# EAGLE design quad_cape (EAGLE 6.1)
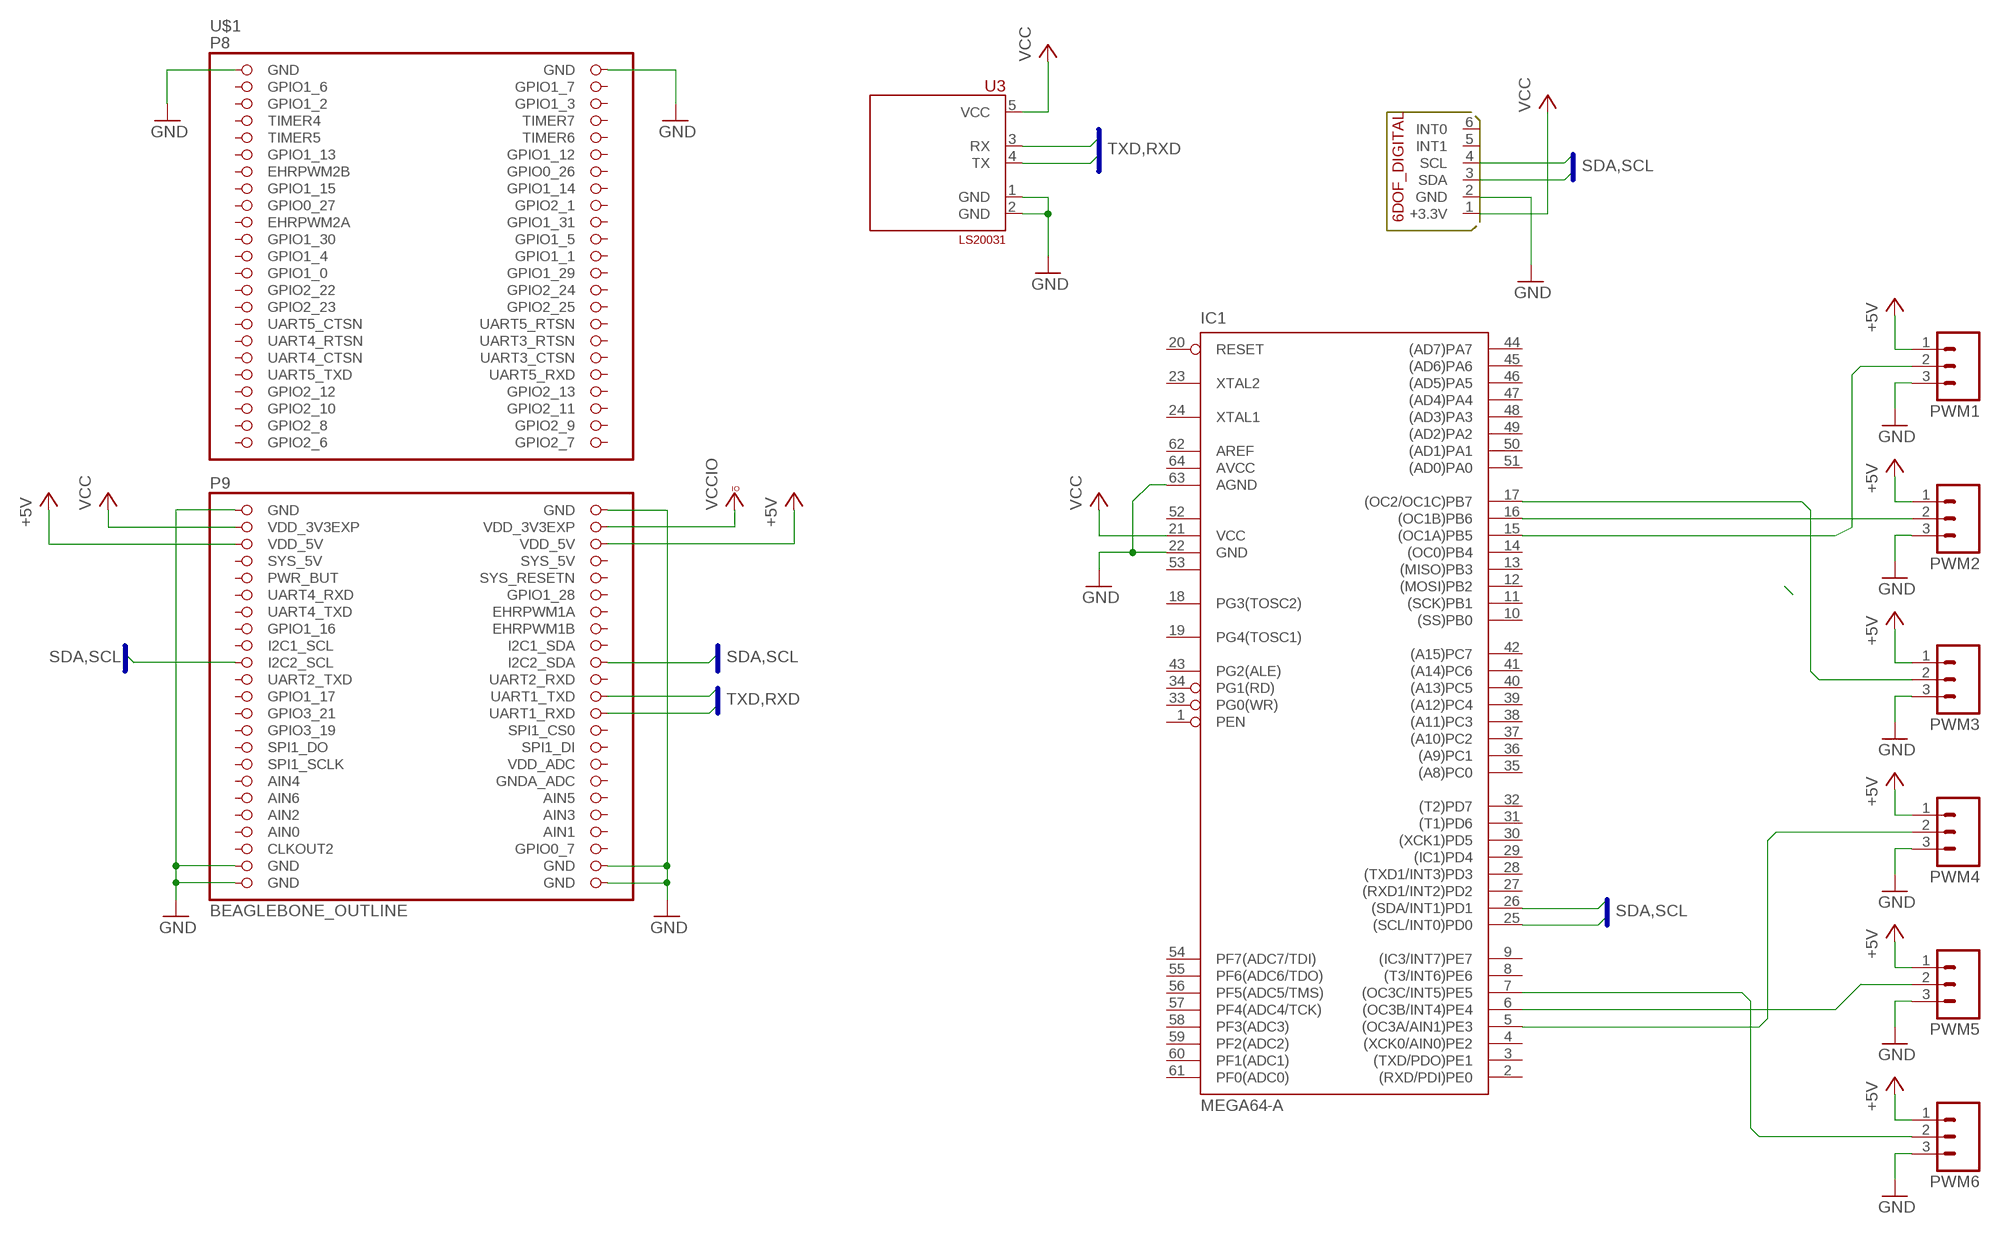
[diagram p0: schematic, sheet 1]

## Parts
IC1  MEGA64-A  [TQFP64]
PWM1  M03  [JST-3-SMD]
PWM2  M03  [JST-3-SMD]
PWM3  M03  [JST-3-SMD]
PWM4  M03  [JST-3-SMD]
PWM5  M03  [JST-3-SMD]
PWM6  M03  [JST-3-SMD]
U3  LS20031  [LS20031]
U$1  BEAGLEBONE_OUTLINE  [BEAGLEBONE_SHIELD]
U$2  6DOF-DIGITAL  [6DOF_DIGITAL_V10]

## Nets
+5V: PWM1.1 PWM2.1 PWM3.1 PWM4.1 PWM5.1 PWM6.1 U$1.51(VDD_5V) U$1.52(VDD_5V)
GND: IC1.22(GND) IC1.63(AGND) PWM1.3 PWM2.3 PWM3.3 PWM4.3 PWM5.3 PWM6.3 U3.1(GND) U3.2(GND) U$1.1(GND) U$1.2(GND) U$1.47(GND) U$1.48(GND) U$1.89(GND) U$1.90(GND) U$1.91(GND) U$1.92(GND) U$2.2(GND)
PWM1: IC1.15((OC1A)PB5) PWM1.2
PWM2: IC1.16((OC1B)PB6) PWM2.2
PWM3: IC1.17((OC2/OC1C)PB7) PWM3.2
PWM4: IC1.5((OC3A/AIN1)PE3) PWM4.2
PWM5: IC1.6((OC3B/INT4)PE4) PWM5.2
PWM6: IC1.7((OC3C/INT5)PE5) PWM6.2
RXD: U3.4(TX) U$1.72(UART1_RXD)
SCL: IC1.25((SCL/INT0)PD0) U$1.65(I2C2_SCL) U$2.4(SCL)
SDA: IC1.26((SDA/INT1)PD1) U$1.66(I2C2_SDA) U$2.3(SDA)
TXD: U3.3(RX) U$1.70(UART1_TXD)
VCC: IC1.21(VCC) U3.5(VCC) U$1.49(VDD_3V3EXP) U$2.1(+3.3V)
VCCIO: U$1.50(VDD_3V3EXP)
Unconnected: IC1.1(PEN) IC1.2((RXD/PDI)PE0) IC1.3((TXD/PDO)PE1) IC1.4((XCK0/AIN0)PE2) IC1.8((T3/INT6)PE6) IC1.9((IC3/INT7)PE7) IC1.10((SS)PB0) IC1.11((SCK)PB1) IC1.12((MOSI)PB2) IC1.13((MISO)PB3) IC1.14((OC0)PB4) IC1.18(PG3(TOSC2)) IC1.19(PG4(TOSC1)) IC1.20(RESET) IC1.23(XTAL2) IC1.24(XTAL1) IC1.27((RXD1/INT2)PD2) IC1.28((TXD1/INT3)PD3) IC1.29((IC1)PD4) IC1.30((XCK1)PD5) IC1.31((T1)PD6) IC1.32((T2)PD7) IC1.33(PG0(WR)) IC1.34(PG1(RD)) IC1.35((A8)PC0) IC1.36((A9)PC1) IC1.37((A10)PC2) IC1.38((A11)PC3) IC1.39((A12)PC4) IC1.40((A13)PC5) IC1.41((A14)PC6) IC1.42((A15)PC7) IC1.43(PG2(ALE)) IC1.44((AD7)PA7) IC1.45((AD6)PA6) IC1.46((AD5)PA5) IC1.47((AD4)PA4) IC1.48((AD3)PA3) IC1.49((AD2)PA2) IC1.50((AD1)PA1) IC1.51((AD0)PA0) IC1.54(PF7(ADC7/TDI)) IC1.55(PF6(ADC6/TDO)) IC1.56(PF5(ADC5/TMS)) IC1.57(PF4(ADC4/TCK)) IC1.58(PF3(ADC3)) IC1.59(PF2(ADC2)) IC1.60(PF1(ADC1)) IC1.61(PF0(ADC0)) IC1.62(AREF) IC1.64(AVCC) U$1.5(GPIO1_2) U$1.6(GPIO1_3) U$1.7(TIMER4) U$1.8(TIMER7) U$1.9(TIMER5) U$1.10(TIMER6) U$1.11(GPIO1_13) U$1.12(GPIO1_12) U$1.13(EHRPWM2B) U$1.14(GPIO0_26) U$1.15(GPIO1_15) U$1.16(GPIO1_14) U$1.17(GPIO0_27) U$1.18(GPIO2_1) U$1.19(EHRPWM2A) U$1.20(GPIO1_31) U$1.21(GPIO1_30) U$1.22(GPIO1_5) U$1.23(GPIO1_4) U$1.24(GPIO1_1) U$1.25(GPIO1_0) U$1.26(GPIO1_29) U$1.27(GPIO2_22) U$1.28(GPIO2_24) U$1.29(GPIO2_23) U$1.30(GPIO2_25) U$1.31(UART5_CTSN) U$1.32(UART5_RTSN) U$1.33(UART4_RTSN) U$1.34(UART3_RTSN) U$1.35(UART4_CTSN) U$1.36(UART3_CTSN) U$1.37(UART5_TXD) U$1.38(UART5_RXD) U$1.39(GPIO2_12) U$1.40(GPIO2_13) U$1.41(GPIO2_10) U$1.53(SYS_5V) U$1.54(SYS_5V) U$1.55(PWR_BUT) U$1.56(SYS_RESETN) U$1.57(UART4_RXD) U$1.58(GPIO1_28) U$1.59(UART4_TXD) U$1.60(EHRPWM1A) U$1.61(GPIO1_16) U$1.62(EHRPWM1B) U$1.63(I2C1_SCL) U$1.64(I2C1_SDA) U$1.67(UART2_TXD) U$1.68(UART2_RXD) U$1.69(GPIO1_17) U$1.71(GPIO3_21) U$1.73(GPIO3_19) U$1.74(SPI1_CS0) U$1.75(SPI1_DO) U$1.76(SPI1_DI) U$1.77(SPI1_SCLK) U$1.78(VDD_ADC) U$1.79(AIN4) U$1.80(GNDA_ADC) U$1.81(AIN6) U$1.82(AIN5) U$1.83(AIN2) U$1.86(AIN1) U$1.87(CLKOUT2) U$1.88(GPIO0_7) U$2.5(INT1) U$2.6(INT0)

## Buses
SDA,SCL
TXD,RXD

## Power pins joined to a net without a drawn wire
AIN0: U$1.85(AIN0)
AIN3: U$1.84(AIN3)
GND1: IC1.53(GND1)
GPIO1_6: U$1.3(GPIO1_6)
GPIO1_7: U$1.4(GPIO1_7)
GPIO2_6: U$1.45(GPIO2_6)
GPIO2_7: U$1.46(GPIO2_7)
GPIO2_8: U$1.43(GPIO2_8)
GPIO2_9: U$1.44(GPIO2_9)
GPIO2_11: U$1.42(GPIO2_11)
VCC1: IC1.52(VCC1)

## Library data of the parts
IC1 = avr:MEGA64: MICROCONTROLLER 64 Kbytes FLASH 4 Kbytes SRAM 2 Kbytes EEPROM DUAL USART 8-channel 10 bit ADC
PWM1-PWM6 = SparkFun-Connectors:M03: Header 3 Standard 3-pin 0.1" header. Use with straight break away headers (SKU : PRT-00116), right angle break away headers (PRT-00553), swiss pins (PRT-00743), machine pins (PRT-00117), and female headers (PRT-00115). Molex polarized connector foot print use with SKU : PRT-08232 with associated crimp pins and housings.
U3 = custom:LS20031: 66 Channel LS20031 GPS 5Hz Receiver
U$1 = adafruit:BEAGLEBONE_OUTLINE: Should match A3 pinout - but not completely tested
U$2 = SparkFun-Breakouts:6DOF-DIGITAL

## Board
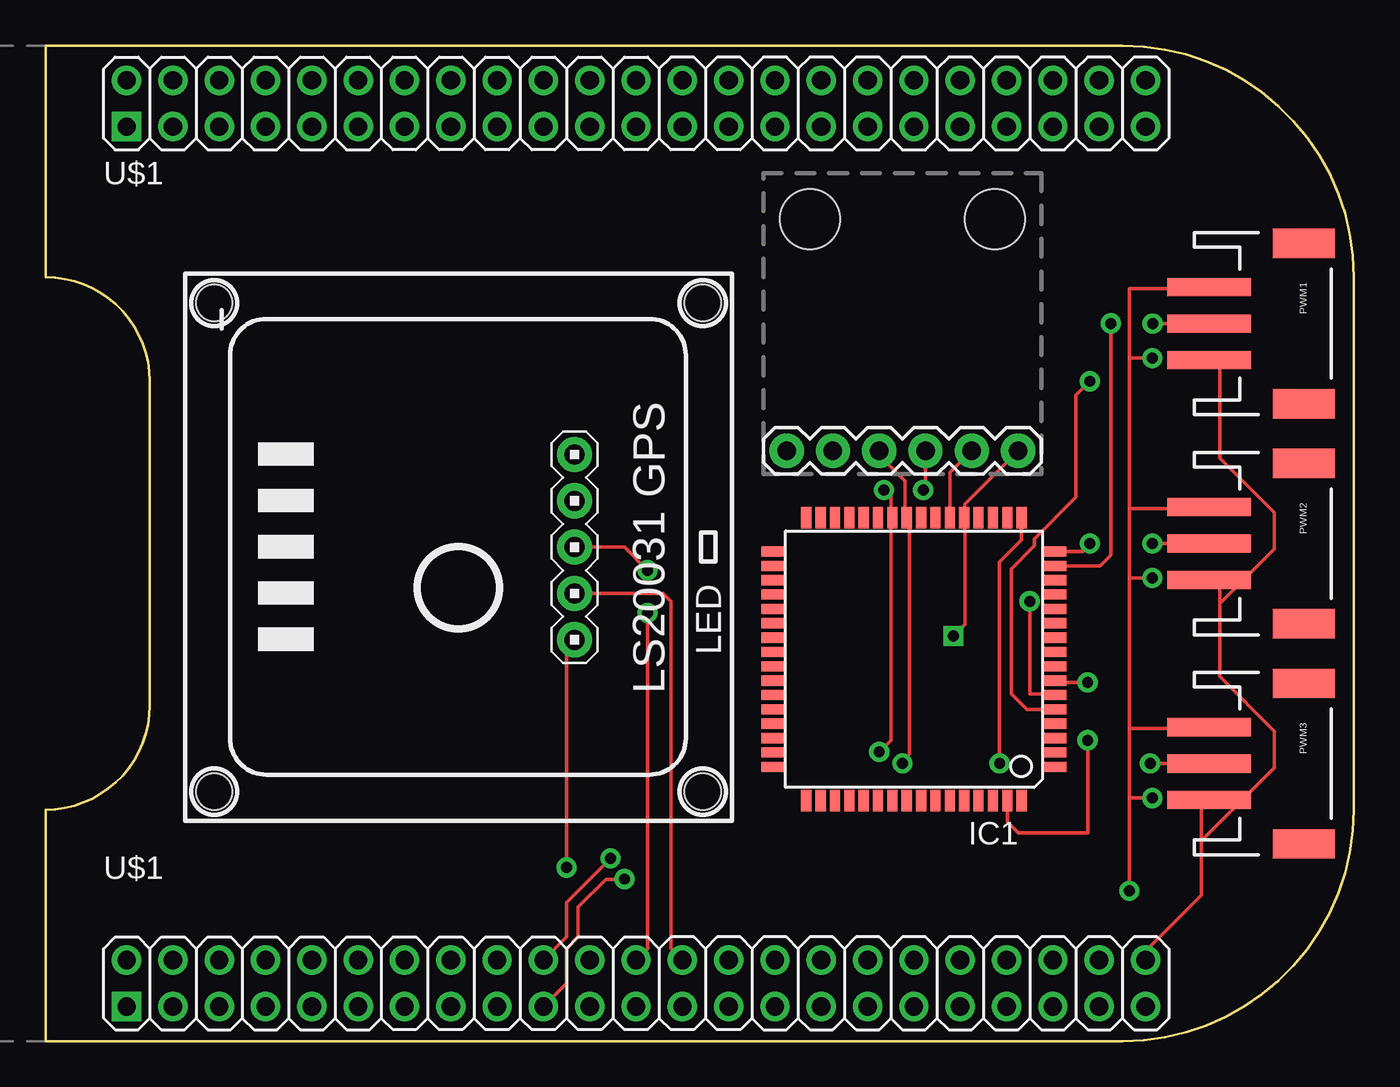
[diagram p1: board, top side]
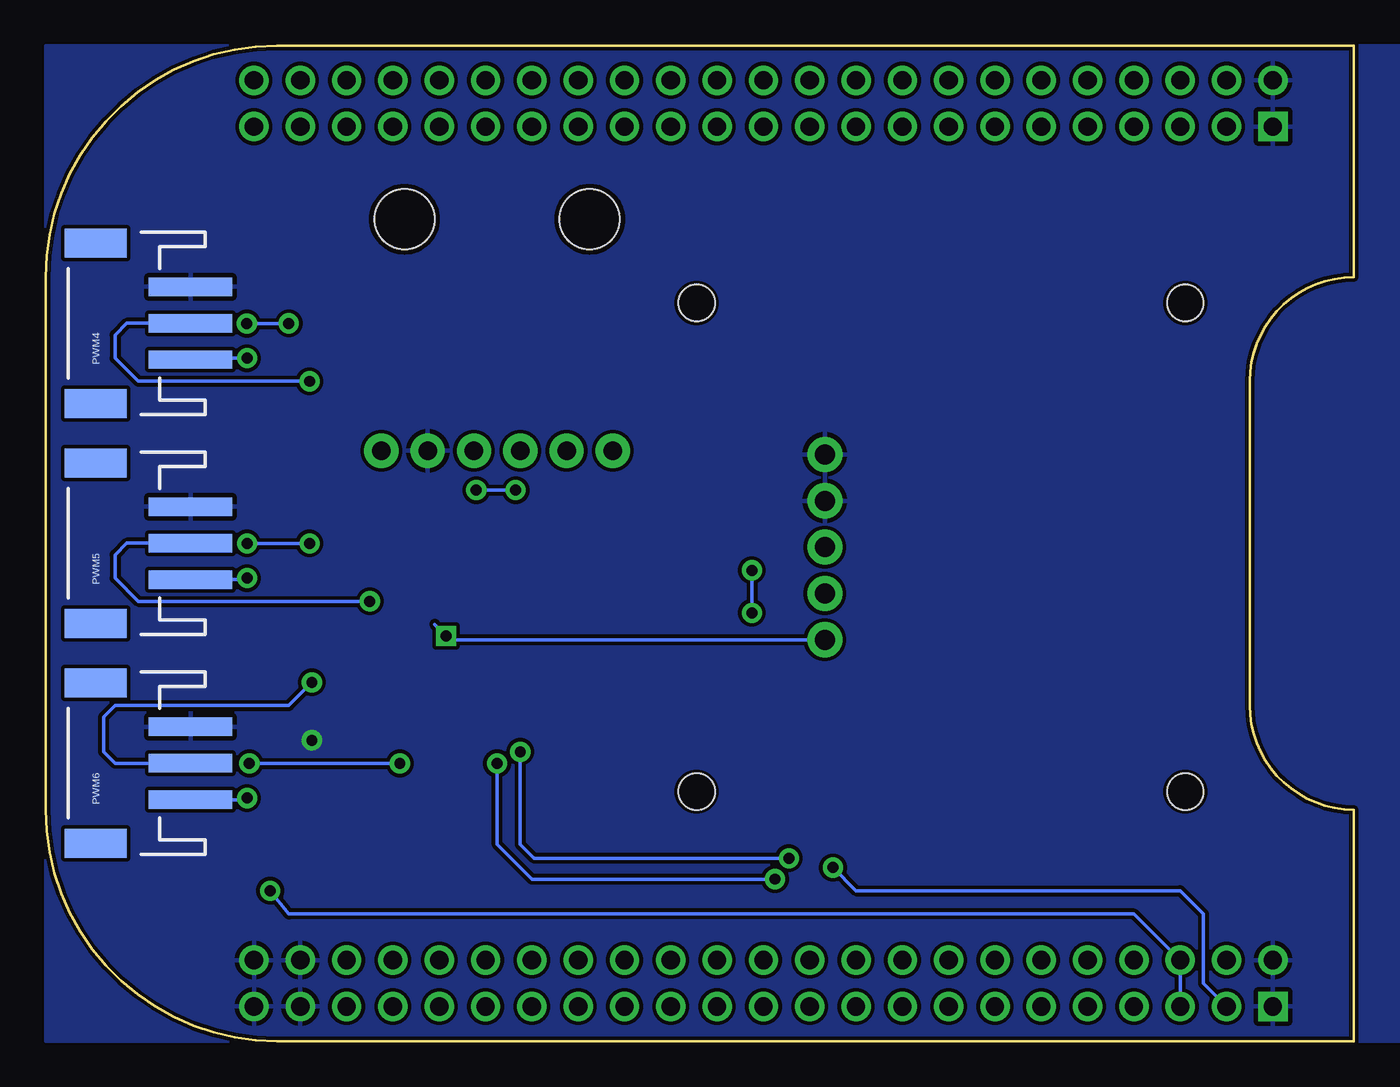
[diagram p2: board, bottom side, seen from below]

Size 71.75 x 54.61 mm. Coordinates in mm from the lower left corner, seen from the top.
Copper layers (1*16): Top 0.035mm / dielectric 1.5mm / Bottom 0.035mm
Design rules: minimum track width 8mil, minimum drill 20mil, track to track 8mil, track to pad 8mil, pad to pad 8mil, via to via 8mil, smd to smd 8mil, copper to edge 8mil, drill to drill 8mil, minimum pad ring 12mil, minimum via ring 10mil, stop-mask expansion 4mil, vias tented up to drill 25mil, thermal gap 10mil

### Footprints (pad centres in the part's own frame; a part is rotated, then mirrored left to right if it is on the bottom)
TQFP64 = smd 1.194 x 0.559: 1 -7.76,5.905; 2 -7.76,5.118; 3 -7.76,4.331; 4 -7.76,3.543; 5 -7.76,2.756; 6 -7.76,1.968; 7 -7.76,1.181; 8 -7.76,0.394; 9 -7.76,-0.394; 10 -7.76,-1.181; 11 -7.76,-1.968; 12 -7.76,-2.756; 13 -7.76,-3.543; 14 -7.76,-4.331; 15 -7.76,-5.118; 16 -7.76,-5.905; 33 7.76,-5.905; 34 7.76,-5.118; 35 7.76,-4.331; 36 7.76,-3.543; 37 7.76,-2.756; 38 7.76,-1.968; 39 7.76,-1.181; 40 7.76,-0.394; 41 7.76,0.394; 42 7.76,1.181; 43 7.76,1.968; 44 7.76,2.756; 45 7.76,3.543; 46 7.76,4.331; 47 7.76,5.118; 48 7.76,5.905 | smd 0.559 x 1.194: 17 -5.905,-7.76; 18 -5.118,-7.76; 19 -4.331,-7.76; 20 -3.543,-7.76; 21 -2.756,-7.76; 22 -1.968,-7.76; 23 -1.181,-7.76; 24 -0.394,-7.76; 25 0.394,-7.76; 26 1.181,-7.76; 27 1.968,-7.76; 28 2.756,-7.76; 29 3.543,-7.76; 30 4.331,-7.76; 31 5.118,-7.76; 32 5.905,-7.76; 49 5.905,7.76; 50 5.118,7.76; 51 4.331,7.76; 52 3.543,7.76; 53 2.756,7.76; 54 1.968,7.76; 55 1.181,7.76; 56 0.394,7.76; 57 -0.394,7.76; 58 -1.181,7.76; 59 -1.968,7.76; 60 -2.756,7.76; 61 -3.543,7.76; 62 -4.331,7.76; 63 -5.118,7.76; 64 -5.905,7.76
JST-3-SMD = smd 1 x 4.6: 1 -1.99,-4.77; 2 0.01,-4.77; 3 2.01,-4.77 | smd 1.6 x 3.4: NC1 -4.39,0.43; NC2 4.41,0.43
LS20031 = drill 1.1 pad 1.93: 1 -5.08,6.35; 2 -2.54,6.35; 3 0,6.35; 4 2.54,6.35; 5 5.08,6.35 | hole 2: -13.39,13.38; 13.41,13.38; 13.41,-13.42; -13.39,-13.42
BEAGLEBONE_SHIELD = drill 1 square: 1 4.445,19.05; 47 52.705,19.05 | drill 1: 2 1.905,19.05; 3 4.445,21.59; 4 1.905,21.59; 5 4.445,24.13; 6 1.905,24.13; 7 4.445,26.67; 8 1.905,26.67; 9 4.445,29.21; 10 1.905,29.21; 11 4.445,31.75; 12 1.905,31.75; 13 4.445,34.29; 14 1.905,34.29; 15 4.445,36.83; 16 1.905,36.83; 17 4.445,39.37; 18 1.905,39.37; 19 4.445,41.91; 20 1.905,41.91; 21 4.445,44.45; 22 1.905,44.45; 23 4.445,46.99; 24 1.905,46.99; 25 4.445,49.53; 26 1.905,49.53; 27 4.445,52.07; 28 1.905,52.07; 29 4.445,54.61; 30 1.905,54.61; 31 4.445,57.15; 32 1.905,57.15; 33 4.445,59.69; 34 1.905,59.69; 35 4.445,62.23; 36 1.905,62.23; 37 4.445,64.77; 38 1.905,64.77; 39 4.445,67.31; 40 1.905,67.31; 41 4.445,69.85; 42 1.905,69.85; 43 4.445,72.39; 44 1.905,72.39; 45 4.445,74.93; 46 1.905,74.93; 48 50.165,19.05; 49 52.705,21.59; 50 50.165,21.59; 51 52.705,24.13; 52 50.165,24.13; 53 52.705,26.67; 54 50.165,26.67; 55 52.705,29.21; 56 50.165,29.21; 57 52.705,31.75; 58 50.165,31.75; 59 52.705,34.29; 60 50.165,34.29; 61 52.705,36.83; 62 50.165,36.83; 63 52.705,39.37; 64 50.165,39.37; 65 52.705,41.91; 66 50.165,41.91; 67 52.705,44.45; 68 50.165,44.45; 69 52.705,46.99; 70 50.165,46.99; 71 52.705,49.53; 72 50.165,49.53; 73 52.705,52.07; 74 50.165,52.07; 75 52.705,54.61; 76 50.165,54.61; 77 52.705,57.15; 78 50.165,57.15; 79 52.705,59.69; 80 50.165,59.69; 81 52.705,62.23; 82 50.165,62.23; 83 52.705,64.77; 84 50.165,64.77; 85 52.705,67.31; 86 50.165,67.31; 87 52.705,69.85; 88 50.165,69.85; 89 52.705,72.39; 90 50.165,72.39; 91 52.705,74.93; 92 50.165,74.93
6DOF_DIGITAL_V10 = drill 1.016 pad 1.88: 1 15.24,13.97; 2 15.24,11.43; 3 15.24,8.89; 4 15.24,6.35; 5 15.24,3.81; 6 15.24,1.27 | hole 3.302: 2.54,12.7; 2.54,2.54

### Placement (x,y rotation side)
IC1  47.62,20.95 180 top
PWM1  68.58,39.37 270 top
PWM2  68.58,27.3 270 top
PWM3  68.58,15.24 270 top
PWM4  68.58,39.37 90 bottom
PWM5  68.58,27.3 90 bottom
PWM6  68.58,15.24 90 bottom
U3  22.67,27.1 270 top
U$1  -14.61,54.61 270 top
U$2  39.37,47.62 270 top

### Tracks (layer width: path | path; a pad name or v marks a point on that pad's centre or on a via)
+5V  (via drill 0.6)
  Top 0.203: v59.44,8.26 59.44,13.34 | 59.44,13.34 59.44,17.14 | 59.44,17.14 59.44,25.4 | 59.44,25.4 59.44,29.21 | 59.44,29.21 59.44,37.47 | 59.44,37.47 59.44,41.27 62.86,41.27 62.86,41.36 | 62.86,41.36 61.68,41.36 | 62.86,41.36 PWM1.1 | PWM3.1 63.72,17.14 59.44,17.14 | PWM2.1 63.72,29.21 59.44,29.21 | v60.71,37.47 59.44,37.47 | v60.71,25.4 59.44,25.4 | v60.71,13.34 59.44,13.34
  Bottom 0.203: U$1.51 U$1.52 12.07,6.99 58.42,6.99 v59.44,8.26 | 64.13,12.93 PWM6.1 60.79,13.25 v60.71,13.34 | 64.13,24.99 PWM5.1 61.05,25.32 v60.71,25.4 | 64.13,37.05 PWM4.1 63.72,37.47 v60.71,37.47
GND  (via drill 0.6)
  Top 0.203: 63.39,11 63.39,8 60.39,5 U$1.92 | 63.39,11 63.39,13 PWM3.3 | 64.39,24 64.39,20 67.39,17 67.39,15 63.39,11 | 64.39,24 64.39,25 PWM2.3 | 64.39,24 67.39,27 67.39,29 64.39,32 64.39,37 PWM1.3 | IC1.63 52.74,12.03 53.34,11.43 57.15,11.43 v57.15,16.51 | IC1.22 49.59,31.18 U$2.2
  pour Bottom: -14.61,54.61 71.75,54.61 71.75,2.54 71.75,0 -14.61,0
PWM1  (via drill 0.6)
  Top 0.203: PWM1.2 v60.72,39.36 | v58.42,39.37 58.42,26.67 57.82,26.07 IC1.15
  Bottom 0.203: v60.72,39.36 60.97,39.37 v58.42,39.37
PWM2  (via drill 0.6)
  Top 0.203: PWM2.2 63.81,27.3 v60.71,27.3 | v57.28,27.3 56.9,26.86 IC1.16
  Bottom 0.203: v60.71,27.3 v57.28,27.3
PWM3  (via drill 0.6)
  Top 0.203: PWM3.2 63.8,15.24 v60.58,15.24 | v52.32,15.24 52.32,26.29 53.53,27.5 IC1.17
  Bottom 0.203: v60.58,15.24 v52.32,15.24
PWM4  (via drill 0.6)
  Top 0.203: v57.28,36.2 56.52,35.43 56.52,29.84 54.23,27.56 54.23,27.18 52.96,25.91 52.96,19.05 53.81,18.2 IC1.5
  Bottom 0.203: PWM4.2 67.3,39.38 67.94,38.73 67.94,37.47 66.67,36.2 v57.28,36.2
PWM5  (via drill 0.6)
  Top 0.203: IC1.6 55.32,19.05 53.97,19.05 v53.97,24.13
  Bottom 0.203: PWM5.2 67.3,27.32 67.94,26.67 67.94,25.4 66.67,24.13 v53.97,24.13
PWM6  (via drill 0.6)
  Top 0.203: v57.15,19.68 55.47,19.68 IC1.7
  Bottom 0.203: PWM6.2 66.04,15.25 66.04,15.24 67.94,15.24 68.58,15.88 68.58,17.78 67.94,18.41 58.42,18.41 v57.15,19.68
RXD
  Top 0.203: U$1.72 34.29,5.08 34.29,24.13 33.86,24.56 U3.4
SCL  (via drill 0.6)
  Top 0.203: U$1.65 28.57,3.17 28.57,5.08 29.21,5.71 29.21,7.37 30.73,8.89 v31.75,8.89 | v46.99,15.24 47.37,15.75 47.37,28.57 IC1.25 47.12,28.83 47.12,30.73 45.72,32.13 U$2.4
  Bottom 0.203: v31.75,8.89 45.08,8.89 46.99,10.79 v46.99,15.24
SDA  (via drill 0.6)
  Top 0.203: U$1.66 28.57,5.71 28.57,7.62 v30.99,10.03 | IC1.26 46.36,28.63 46.36,28.57 | 46.36,28.57 46.36,16.51 v45.72,15.88 | U$2.3 48.26,30.35 v48.13,30.23 | v45.97,30.23 46.36,29.84 46.36,28.57
  Bottom 0.203: v30.99,10.03 36.58,10.03 44.96,10.03 45.72,10.79 v45.72,15.88 | v48.13,30.23 v45.97,30.23
TXD  (via drill 0.6)
  Top 0.203: U3.3 31.75,27.1 v33.02,25.83 | v33.02,23.5 33.02,5.08 U$1.70
  Bottom 0.203: v33.02,25.83 v33.02,23.5
VCC  (via drill 0.6)
  Top 0.203: U3.5 28.57,21.58 v28.57,9.53 | U$2.1 50.42,29.46 IC1.21 50.38,28.49 50.42,28.45 50.42,22.86 v49.78,22.23
  Bottom 0.203: v28.57,9.53 27.3,8.26 9.52,8.26 8.25,6.99 8.25,3.17 U$1.49 | U3.5 49.58,22.02 v49.78,22.23 50.42,22.86